# EAGLE design 491 Circuit Schematic For Actual PCB (EAGLE 9.5.0)
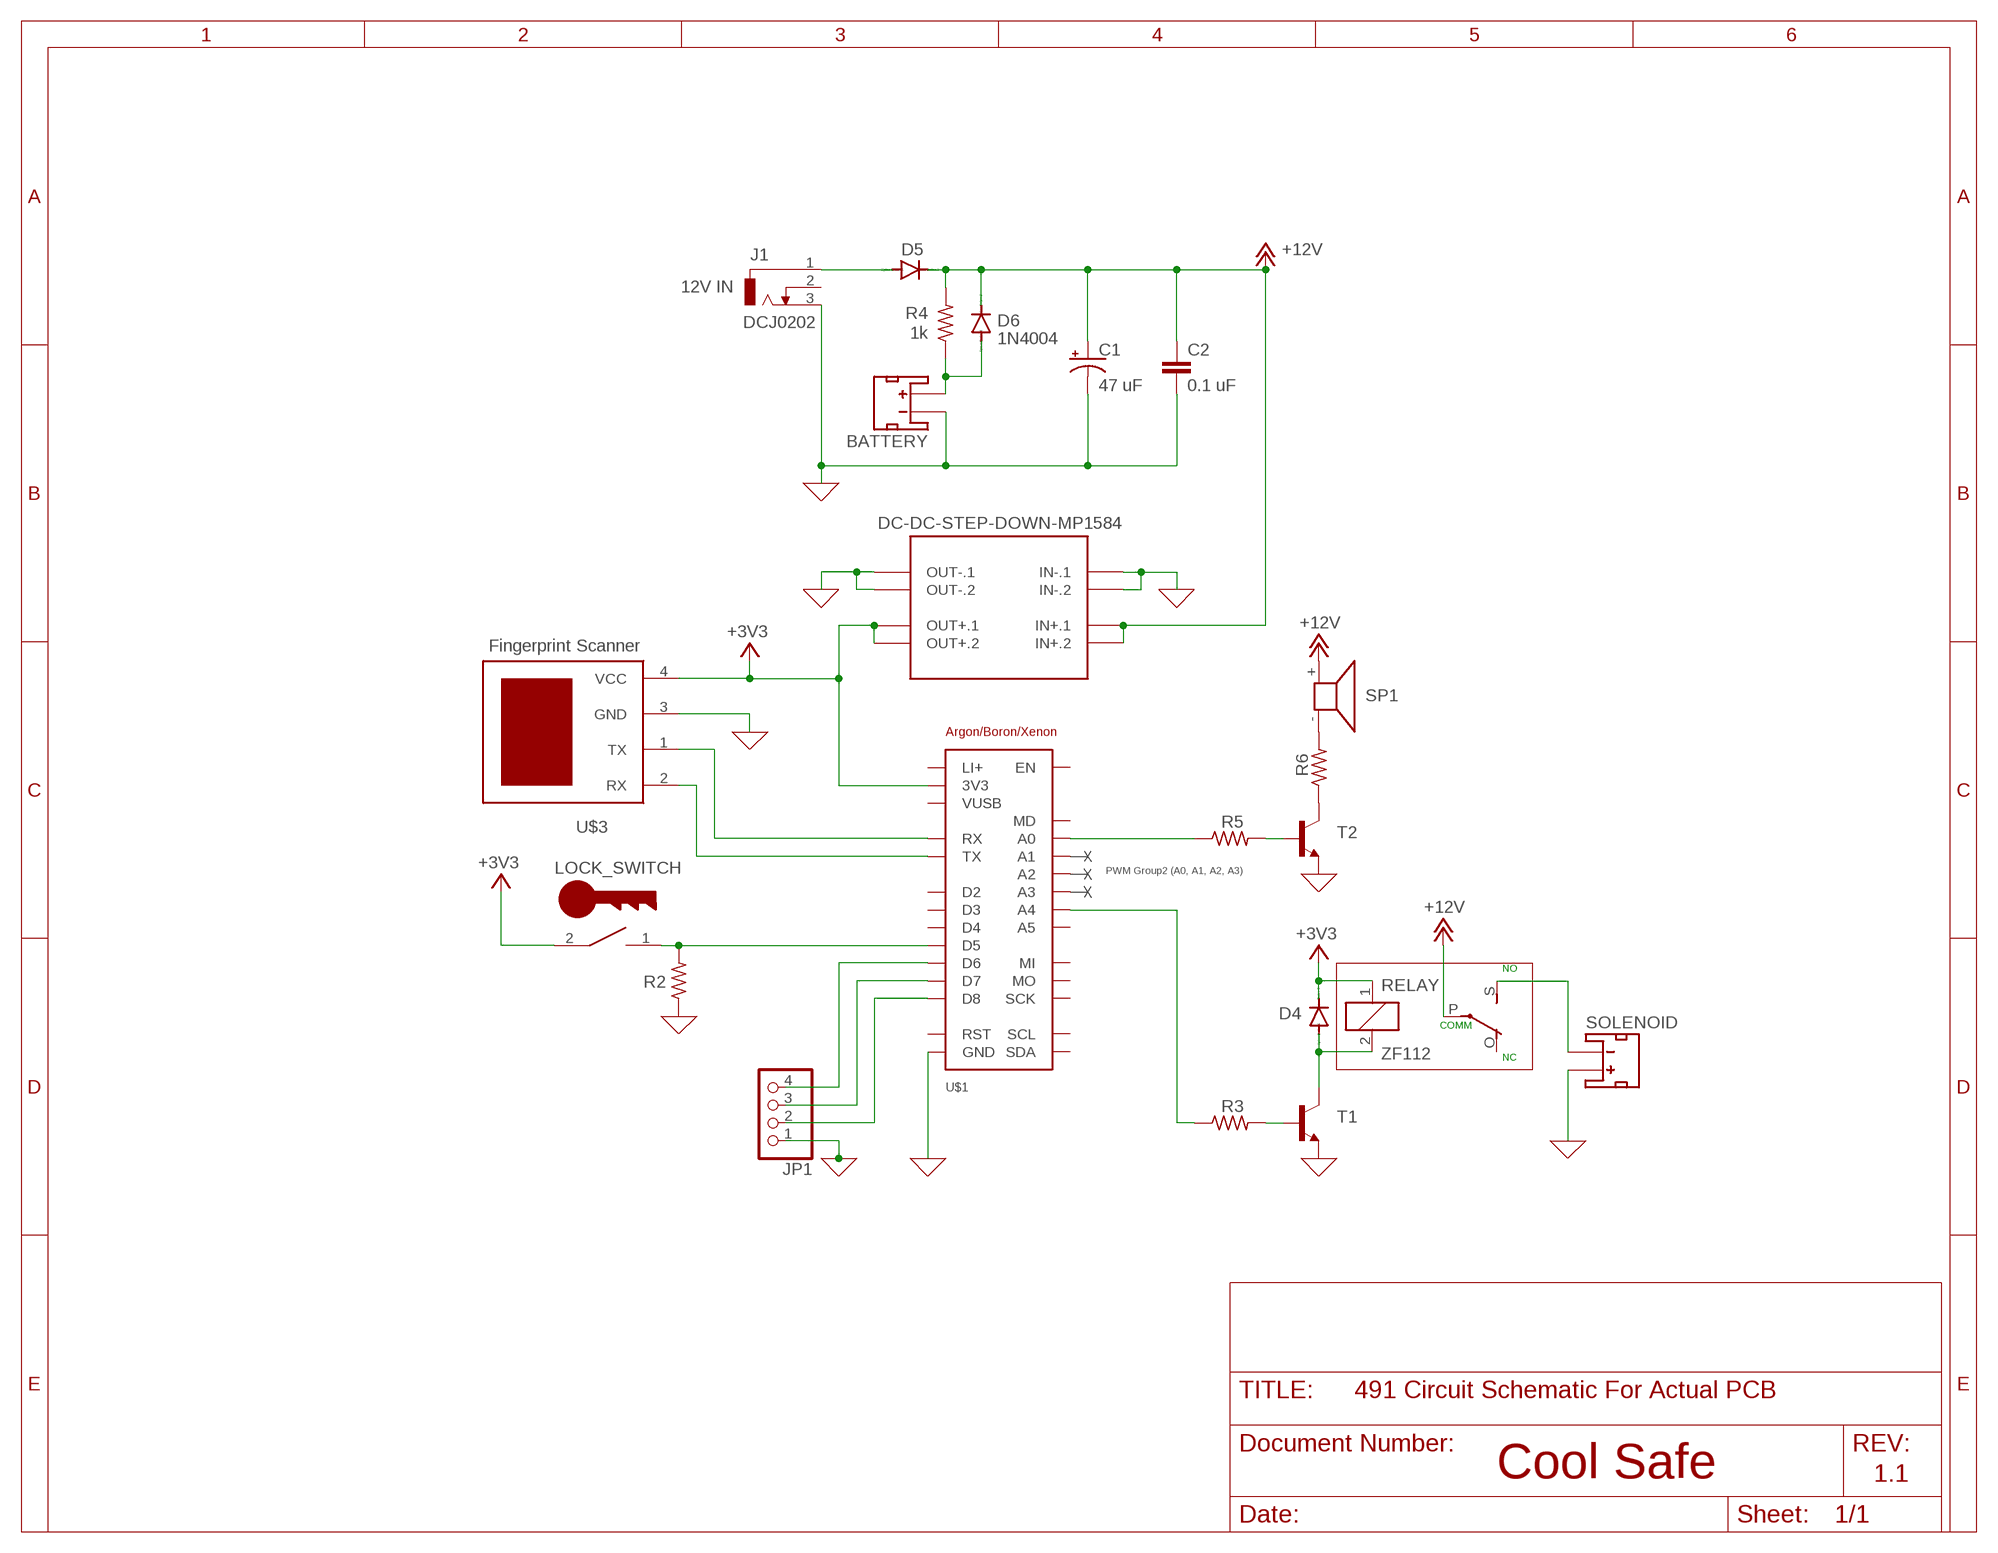
[diagram p0: schematic, sheet 1]

## Parts
BATTERY  JST_2MM_MALE  [JST-2-SMD]
C1  47 uF  CPOL-USE2.5-6  [E2,5-6]
C2  0.1 uF  C2.5/5  [C2.5-5]
D4  1N4004  [DO41-10]
D5  1N4004  [DO41-10]
D6  1N4004  [DO41-10]
J1  DCJ0202  [DCJ0202]
JP1  PINHD-1X4/90  [1X04/90]
LOCK_SWITCH  LOCK_SWITCHSCREW_TERMINAL  [1751248]
R2  R-US_0207/10  [0207/10]
R3  R-US_0204/7  [0204/7]
R4  1k  R-US_0207/10  [0207/10]
R5  R-US_0204/7  [0204/7]
R6  R-US_0204/7  [0204/7]
RELAY  ZF112  [ZF112]
SOLENOID  JST_2MM_MALE  [JST-2-SMD]
SP1  KSS1201  [KSS1201]
T1  -NPN-TO92  [TO92]
T2  -NPN-TO92  [TO92]
U$1  TEMPLATE_ARGON/BORON/XENONFEATHER_ONLY  [FEATHER_ONLY]
U$2  DC-DC-STEP-DOWN-MP1584  [DC-DC-STEP-DOWN-MP1584]
U$3  FPSQWIIC  [1X04_1MM_RA]

## Nets
0: BATTERY.1(-) C1.- C2.2 J1.3 JP1.1 R2.1 SOLENOID.2(+) T1.1(E) T2.1(E) U$1.16B(GND) U$1.16T(GND) U$1.P$16(GND) U$2.IN-.1 U$2.IN-.2 U$2.OUT-.1 U$2.OUT-.2 U$3.3(GND) ; supply symbol labelled GND
+3V3: D4.C LOCK_SWITCH.2 RELAY.1 U$1.14B(3V3) U$1.14T(3V3) U$1.P$14(3V3) U$2.OUT+.1 U$2.OUT+.2 U$3.4(VCC)
+12V: C1.+ C2.1 D5.C D6.C R4.2 RELAY.P(2:P) SP1.+ U$2.IN+.1 U$2.IN+.2
N$1: BATTERY.2(+) D6.A R4.1
N$2: R5.2 T2.2(B)
N$4: R5.1 U$1.17B(A0) U$1.17T(A0) U$1.P$17(A0)
N$6: JP1.4 U$1.06B(D6) U$1.06T(D6) U$1.P$6(D6)
N$7: JP1.3 U$1.05B(D7) U$1.05T(D7) U$1.P$5(D7)
N$8: JP1.2 U$1.04B(D8) U$1.04T(D8) U$1.P$4(D8)
N$9: LOCK_SWITCH.1 R2.2 U$1.07B(D5) U$1.07T(D5) U$1.P$7(D5)
N$11: D4.A RELAY.2 T1.3(C)
N$13: RELAY.S(2:S) SOLENOID.1(-)
N$15: R6.1 T2.3(C)
N$16: U$1.26B(RX) U$1.26T(RX) U$1.P$26(RX) U$3.1(TX)
N$17: R3.2 T1.2(B)
N$18: R3.1 U$1.21B(A4) U$1.21T(A4) U$1.P$21(A4)
N$28: U$1.27B(TX) U$1.27T(TX) U$1.P$27(TX) U$3.2(RX)
N$29: D5.A J1.1
N$31: R6.2 SP1.-
Unconnected: BATTERY.NC1(PAD1) BATTERY.NC2(PAD2) J1.2 RELAY.O(2:O) SOLENOID.NC1(PAD1) SOLENOID.NC2(PAD2) U$1.01B(LI+) U$1.01T(LI+) U$1.02B(EN) U$1.02T(EN) U$1.03B(VUSB) U$1.03T(VUSB) U$1.08B(D4) U$1.08T(D4) U$1.09B(D3) U$1.09T(D3) U$1.10B(D2) U$1.10T(D2) U$1.11B(SCL) U$1.11T(SCL) U$1.12B(SDA) U$1.12T(SDA) U$1.13B(RST) U$1.13T(RST) U$1.15B(MD) U$1.15T(MD) U$1.18B(A1) U$1.18T(A1) U$1.19B(A2) U$1.19T(A2) U$1.20B(A3) U$1.20T(A3) U$1.22B(A5) U$1.22T(A5) U$1.23B(SCK) U$1.23T(SCK) U$1.24B(MO) U$1.24T(MO) U$1.25B(MI) U$1.25T(MI) U$1.P$1(LI+) U$1.P$2(EN) U$1.P$3(VUSB) U$1.P$8(D4) U$1.P$9(D3) U$1.P$10(D2) U$1.P$11(SCL) U$1.P$12(SDA) U$1.P$13(RST) U$1.P$15(MD) U$1.P$18(A1) U$1.P$19(A2) U$1.P$20(A3) U$1.P$22(A5) U$1.P$23(SCK) U$1.P$24(MO) U$1.P$25(MI)

## Notes on the sheet
- 12V IN
- Fingerprint Scanner
- PWM Group2 (A0, A1, A2, A3)
- NO
- COMM
- NC
- Cool Safe | 1.1

## Library data of the parts
BATTERY SOLENOID = cool_safe_lib:JST_2MM_MALE: JST 2MM MALE RA CONNECTOR Two pin, compact surface mount connector. Commonly used as a battery input connection point. We really like the solid locking feeling and high current rating on these small connectors. We use these all the time as battery connectors. Mates to single-cell LiPo batteries. Here is the connector we sell at SparkFun: JST Right Angle Connector - White <https://www.sparkfun.com/products/8612> (PRT-08612) Datasheet <http://www.sparkfun.com/datasheets/Prototyping/Connectors/JST-Horizontal.pdf> It was used on these SparkFun products: SparkFun MOSFET Power Controller <https://www.sparkfun.com/products/11214> (PRT-11214) SparkFun Battery Babysitter - LiPo Battery Manager <https://www.sparkfun.com/products/13777> (PRT-13777) And many, many others that required a lipo battery connection.; PROD_ID: CONN-11443; SF_ID: PRT-08612
C1 = rcl:CPOL-US: POLARIZED CAPACITOR, American symbol; SPICEPREFIX: C
C2 = capacitor-wima:C: CAPACITOR naming: grid - package width
D4-D6 = diode:1N4004: DIODE general purpose rectifier, 1 A
J1 = con-jack:DCJ0202: DC POWER JACK Source: DCJ0202.pdf; OC_FARNELL: unknown; OC_NEWARK: unknown
JP1 = pinhead:PINHD-1X4: PIN HEADER
LOCK_SWITCH = cool_safe_lib:LOCK_SWITCH
R2-R6 = rcl:R-US_: RESISTOR, American symbol; SPICEPREFIX: R
RELAY = relay:ZF112: RELAY 1 x switch; OC_FARNELL: unknown; OC_NEWARK: unknown
SP1 = buzzer:KSS1201: SPEAKER Source: Schukat; OC_FARNELL: unknown; OC_NEWARK: unknown
T1 T2 = transistor:*-NPN-: NPN Transistror BF959 corrected 2008.03.06
U$1 = cool_safe_lib:TEMPLATE_ARGON/BORON/XENON
U$2 = cool_safe_lib:DC-DC-STEP-DOWN-MP1584: DC/DC Step-Down Regulator based on MP1584 chip MP1584 datasheet available here: http://www.haoyuelectronics.com/Attachment/MP1584/MP1584.pdf Click here to find device on ebay.com <http://www.ebay.com/sch/mp1584+module>
U$3 = cool_safe_lib:FPS

## Module SWITCHINGMODULE
Ports: 

### Library data of the parts

## Board
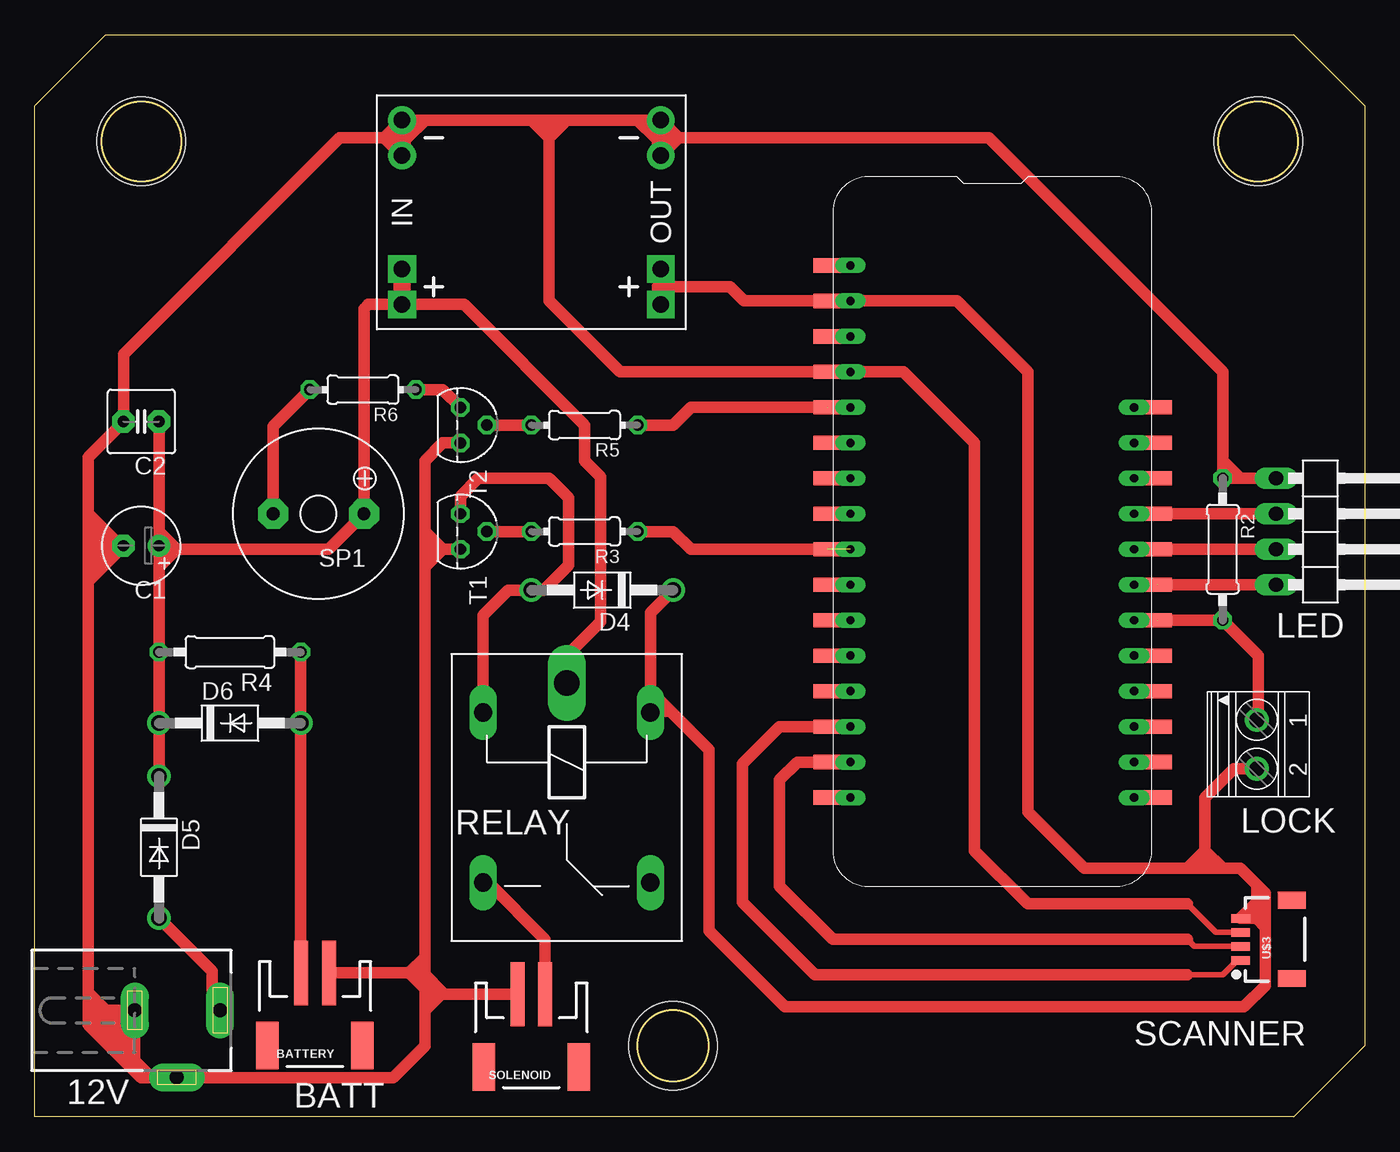
[diagram p1: board, top side]
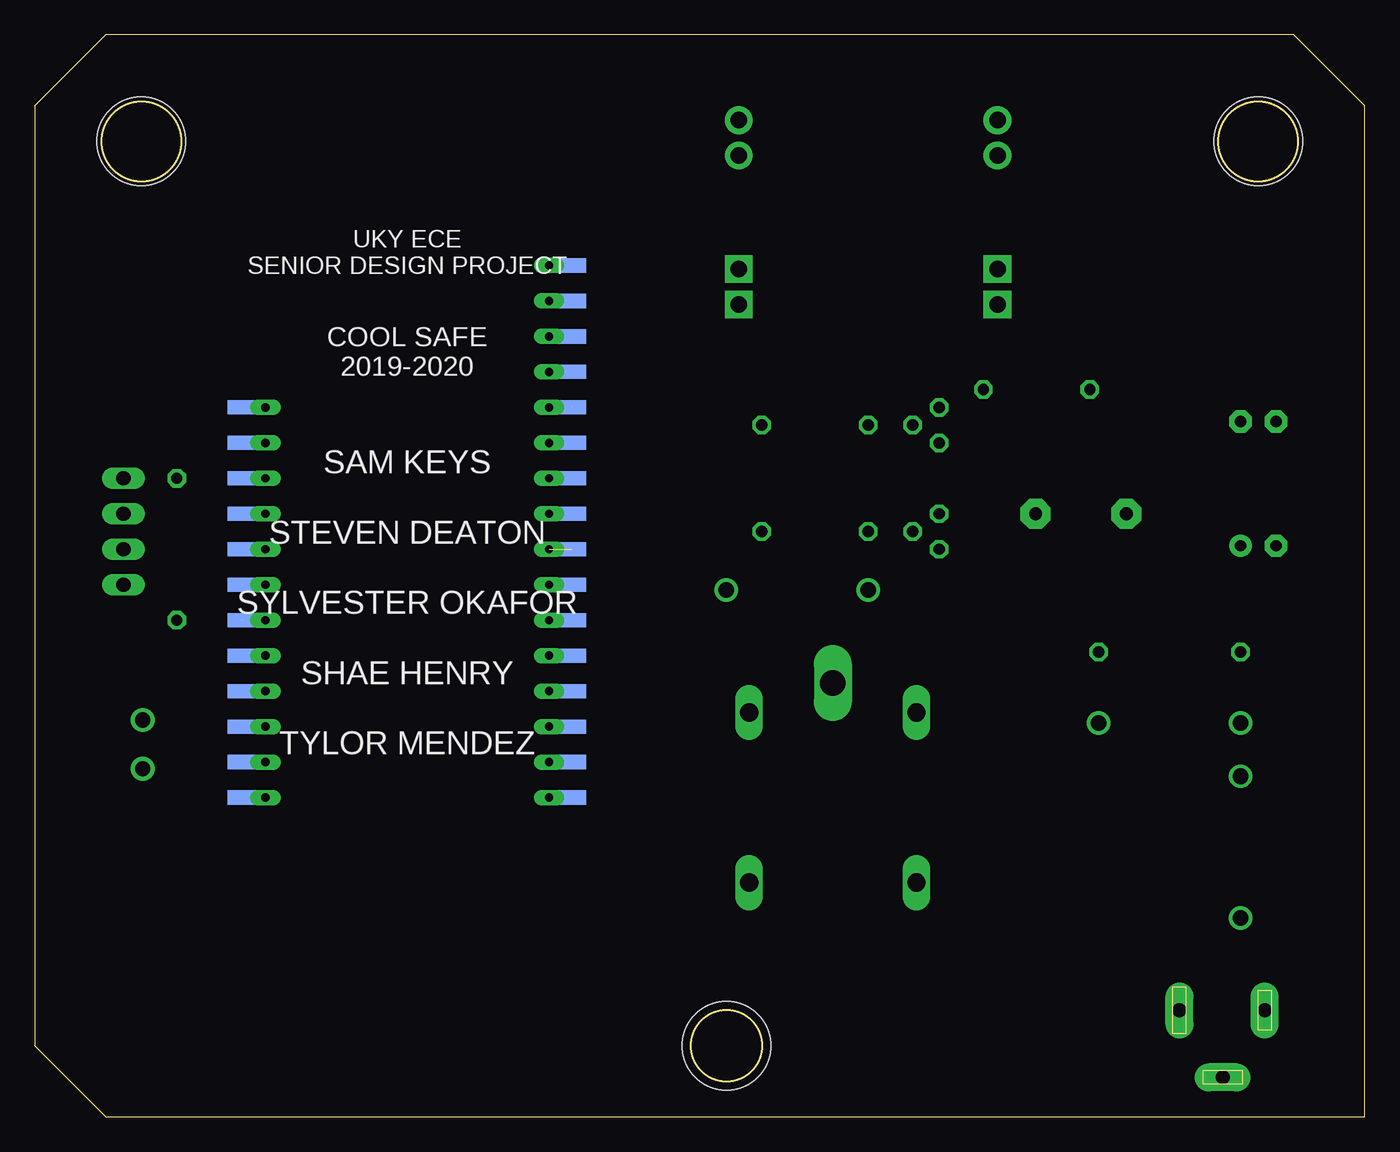
[diagram p2: board, bottom side, seen from below]

Size 95.25 x 77.47 mm. Coordinates in mm from the lower left corner, seen from the top.
Outline: 0,72.39 5.08,77.47 90.17,77.47 95.25,72.39 95.25,5.08 90.17,0 0,0 0,72.39
Outline: circle at 45.72,5.08 radius 2.54
Outline: circle at 7.62,69.85 radius 2.84
Outline: circle at 87.63,69.85 radius 2.84
Copper layers (1*16): Top 0.035mm / dielectric 1.5mm / Bottom 0.035mm
Design rules "default": minimum track width 6mil, minimum drill 0.35mm, track to track 6mil, track to pad 6mil, pad to pad 6mil, via to via 6mil, smd to smd 6mil, copper to edge 40mil, drill to drill 6mil, minimum pad ring 10mil, minimum via ring 8mil, stop-mask expansion 4mil, vias tented up to drill 0mil, thermal gap 10mil
Holes 6.35 mm at 7.62,69.85 87.63,69.85 45.72,5.08

### Footprints (pad centres in the part's own frame; a part is rotated, then mirrored left to right if it is on the bottom)
JST-2-SMD = smd 1 x 4.6: 1 -1,-3.7; 2 1,-3.7 | smd 1.6 x 3.4: NC1 -3.4,1.5; NC2 3.4,1.5
E2,5-6 = drill 0.813 pad 1.6: + -1.27,0 | drill 0.813 pad 1.6 octagon: - 1.27,0
C2.5-5 = drill 0.813 pad 1.6 octagon: 1 -1.27,0; 2 1.27,0
DO41-10 = drill 1.118: A 5.08,0; C -5.08,0
DCJ0202 = drill 1 pad 2 long: 1 0,3.1; 2 4.8,0; 3 0,-3
1X04/90 = drill 1.016 long: 1 -3.81,-3.81; 2 -1.27,-3.81; 3 1.27,-3.81; 4 3.81,-3.81
1751248 = drill 1.1 pad 1.7: 1 -1.75,-0.1; 2 1.75,-0.1
0207/10 = drill 0.813 octagon: 1 -5.08,0; 2 5.08,0
0204/7 = drill 0.813 octagon: 1 -3.81,0; 2 3.81,0
ZF112 = drill 1.321 long: 1 -6.096,5.994; 2 -6.096,-5.994; O 6.096,5.994; S 6.096,-5.994 | drill 1.803 long: P -8.204,0
KSS1201 = drill 0.914 pad 2.159 octagon: + 3.251,0; - -3.251,0
TO92 = drill 0.813 octagon: 1 1.27,0; 2 0,1.905; 3 -1.27,0
FEATHER_ONLY = smd 1.016 x 2.032 bottom: 01B 17.78,25.8; 02B 20.32,25.8; 03B 22.86,25.8; 04B 25.4,25.8; 05B 27.94,25.8; 06B 30.48,25.8; 07B 33.02,25.8; 08B 35.56,25.8; 09B 38.1,25.8; 10B 40.64,25.8; 11B 43.18,25.8; 12B 45.72,25.8; 13B 7.62,2.159; 14B 10.16,2.159; 15B 12.7,2.159; 16B 15.24,2.159; 17B 17.78,2.159; 18B 20.32,2.159; 19B 22.86,2.159; 20B 25.4,2.159; 21B 27.94,2.159; 22B 30.48,2.159; 23B 33.02,2.159; 24B 35.56,2.159; 25B 38.1,2.159; 26B 40.64,2.159; 27B 43.18,2.159; 28B 45.72,2.159 | smd 1.016 x 2.032: 01T 17.78,25.8; 02T 20.32,25.8; 03T 22.86,25.8; 04T 25.4,25.8; 05T 27.94,25.8; 06T 30.48,25.8; 07T 33.02,25.8; 08T 35.56,25.8; 09T 38.1,25.8; 10T 40.64,25.8; 11T 43.18,25.8; 12T 45.72,25.8; 13T 7.62,2.159; 14T 10.16,2.159; 15T 12.7,2.159; 16T 15.24,2.159; 17T 17.78,2.159; 18T 20.32,2.159; 19T 22.86,2.159; 20T 25.4,2.159; 21T 27.94,2.159; 22T 30.48,2.159; 23T 33.02,2.159; 24T 35.56,2.159; 25T 38.1,2.159; 26T 40.64,2.159; 27T 43.18,2.159; 28T 45.72,2.159 | drill 0.6 long: P$1 17.78,24.13; P$2 20.32,24.13; P$3 22.86,24.13; P$4 25.4,24.13; P$5 27.94,24.13; P$6 30.48,24.13; P$7 33.02,24.13; P$8 35.56,24.13; P$9 38.1,24.13; P$10 40.64,24.13; P$11 43.18,24.13; P$12 45.72,24.13; P$13 7.62,3.81; P$14 10.16,3.81; P$15 12.7,3.81; P$16 15.24,3.81; P$17 17.78,3.81; P$18 20.32,3.81; P$19 22.86,3.81; P$20 25.4,3.81; P$21 27.94,3.81; P$22 30.48,3.81; P$23 33.02,3.81; P$24 35.56,3.81; P$25 38.1,3.81; P$26 40.64,3.81; P$27 43.18,3.81; P$28 45.72,3.81
DC-DC-STEP-DOWN-MP1584 = drill 1.2 pad 2 square: IN+.1 -9.271,-4.064; IN+.2 -9.271,-6.604; OUT+.1 9.271,-4.064; OUT+.2 9.271,-6.604 | drill 1.2 pad 2: IN-.1 -9.271,6.604; IN-.2 -9.271,4.064; OUT-.1 9.271,6.604; OUT-.2 9.271,4.064
1X04_1MM_RA = smd 0.6 x 1.35: 1 -1.5,0; 2 -0.5,0; 3 0.5,0; 4 1.5,0 | smd 1.2 x 2: NC1 2.8,-3.675; NC2 -2.8,-3.675

### Placement (x,y rotation side)
BATTERY  20.07,6.6 180 top
C1  7.62,40.89 180 top
C2  7.62,49.78 180 top
D4  40.64,37.72 180 top
D5  8.89,19.3 270 top
D6  13.97,28.19 0 top
J1  10.16,7.62 270 top
JP1  92.71,41.91 270 top
LOCK_SWITCH  87.63,26.67 270 top
R2  85.09,40.64 270 top
R3  39.37,41.91 180 top
R4  13.97,33.27 180 top
R5  39.37,49.53 180 top
R6  23.5,52.07 180 top
RELAY  38.1,22.86 270 top
SOLENOID  35.56,5.08 180 top
SP1  20.32,43.18 0 top
T1  30.48,41.91 270 top
T2  30.48,49.53 270 top
U$1  54.61,68.58 270 top
U$2  35.56,64.77 0 top
U$3  86.36,12.7 90 top

### Tracks (layer width: path | path; a pad name or v marks a point on that pad's centre or on a via)
0
  Top 0.406: 26.04,71.12 U$2.IN-.1 | U$3.3 84.59,13.2 82.55,15.24
  Top 0.813: 3.81,39.5 3.81,38.35 | 3.81,39.5 3.81,40.89 | 3.81,40.89 3.81,42.04 | 3.81,42.04 3.81,43.18 | 3.81,43.18 3.81,47.24 C2.2 6.35,54.61 21.84,70.1 25.02,70.1 | C1.- 3.81,40.89 | 7.11,3.3 7.62,2.79 8.38,2.79 | 7.11,3.3 3.81,6.6 | 8.38,2.79 25.65,2.79 27.94,5.08 27.94,7.62 | 27.94,71.37 U$2.IN-.1 25.02,70.1 | 35.56,71.37 27.94,71.37 | 35.56,71.37 36.83,71.37 | 36.83,71.37 38.1,71.37 | 38.1,71.37 43.18,71.37 | 43.18,71.37 U$2.OUT-.1 46.1,70.1 | 36.83,70.1 36.83,58.42 41.91,53.34 U$1.P$16 62.23,53.34 67.31,48.26 67.31,19.05 71.12,15.24 82.55,15.24 | 36.83,70.1 36.83,71.37 | 29.21,40.64 27.94,39.37 | 27.94,10.16 27.94,9.18 | 27.94,8.89 27.94,7.62 | 29.21,40.64 T1.1 27.94,40.64 | 29.21,40.64 27.94,41.91 | R2.1 86.36,45.72 85.09,46.99 | 85.09,46.99 85.09,53.34 68.33,70.1 46.1,70.1 | 85.09,46.99 R2.1 | 27.94,41.91 27.94,46.99 29.21,48.26 T2.1 | C1.- 3.81,38.35 | C1.- 6.1,40.89 3.81,43.18 | C1.- 4.95,40.89 3.81,42.04 | C1.- 5.21,40.89 3.81,39.5 | 35.56,71.37 36.83,70.1 | 36.83,70.1 38.1,71.37 | 25.02,70.1 26.29,70.1 26.67,70.1 27.94,71.37 | 46.1,70.1 44.83,70.1 44.45,70.1 43.18,71.37 | U$2.IN-.2 25.02,70.1 | U$2.OUT-.2 46.1,70.1 | 29.1,8.78 28.05,8.78 27.94,8.89 | 29.1,8.78 29.21,8.78 | 29.1,8.78 27.94,7.62 | 29.21,8.78 29.21,8.89 27.94,10.16 | JP1.1 R2.1 | 3.81,38.35 3.81,8.89 | 3.81,8.89 3.81,7.62 | 3.81,7.62 3.81,6.6 | 27.94,41.91 27.94,40.64 | 27.94,40.64 27.94,39.37 | 27.94,39.37 27.94,11.43 | 27.94,11.43 27.94,10.16 | 5.08,7.62 3.81,7.62 | 6.35,7.62 J1.3 7.16,4.02 | 3.81,8.89 5.08,7.62 | 7.16,4.02 7.16,3.35 7.11,3.3 | 7.16,4.02 8.38,2.79 | 4.06,6.6 4.57,6.6 4.95,6.22 | 4.95,6.22 5.52,5.65 | 5.52,5.65 6.22,4.95 | 6.22,4.95 7.16,4.02 | 5.08,7.62 4.06,6.6
  Top 0.813: 4.06,6.6 3.81,6.6 | 5.08,7.62 5.08,6.48 | 5.08,6.48 5.08,6.35 4.95,6.22 | 6.35,6.48 6.35,5.08 6.22,4.95 | 5.08,7.62 6.35,7.62 | 6.35,7.62 6.35,6.48 | 6.35,6.48 5.52,5.65 | 6.35,7.62 5.21,6.48 5.08,6.48 | SOLENOID.2 29.21,8.78 | BATTERY.1 26.81,10.3 | 26.81,10.3 27.94,11.43 | 26.81,10.3 27.94,9.18 | 27.94,9.18 27.94,8.89 | 27.94,10.16 27.8,10.3 26.81,10.3
  Top 1.27: U$2.IN-.2 26.29,70.1 U$2.IN-.1 | U$2.OUT-.1 44.83,70.1 U$2.OUT-.2
+3V3
  Top 0.813: D4.C 44.1,36.1 44.1,30.48 | 85.09,17.78 86.36,17.78 87.63,16.51 | 82.55,17.78 75.18,17.78 71.12,21.84 71.12,53.34 66.04,58.42 U$1.P$14 50.8,58.42 49.78,59.44 44.83,59.44 U$2.OUT+.1 | 85.09,17.78 83.82,19.05 | 83.82,19.05 82.55,17.78 | 44.1,30.48 RELAY.1 44.17,29.04 45.55,29.04 | 45.55,29.04 48.29,26.29 48.29,13.3 53.72,7.87 86.61,7.87 88.14,9.4 88.14,13.59 | 45.55,29.04 44.1,30.48 | 83.82,19.05 83.82,22.86 85.88,24.92 LOCK_SWITCH.2 | 87.63,16.51 88.14,16 88.14,13.59 | U$3.4 87.53,14.2 | 88.14,13.59 87.53,14.2 | 87.53,14.2 87.53,15.24 | 87.53,15.24 87.53,15.37 | 87.63,16.51 87.53,16.41 87.53,15.37 | U$3.4 86.49,14.2 87.53,15.24 | U$3.4 87.53,15.37 | 82.55,17.78 83.82,17.78 | 83.82,17.78 85.09,17.78 | 83.82,19.05 83.82,17.78
  Top 1.27: 44.83,59.44 U$2.OUT+.2
+12V
  Top 0.813: D5.C D6.C R4.2 C1.+ | C2.1 8.89,41.91 | C1.+ 8.89,40.64 10.16,40.64 | C1.+ 8.89,39.37 10.16,40.64 | 8.89,41.91 C1.+ | 10.16,40.64 21.03,40.64 SP1.+ 23.57,57.86 23.88,58.17 U$2.IN+.2 30.73,58.17 39.37,49.53 39.37,46.99 40.51,45.85 40.51,35.43 38.1,33.02 RELAY.P | 10.16,40.64 8.89,41.91
  Top 1.27: U$2.IN+.1 U$2.IN+.2
N$1
  Top 0.813: R4.1 D6.A 19.05,10.32 BATTERY.2
N$2
  Top 0.813: R5.2 T2.2
N$4  (1 unrouted)
  Top 0.813: U$1.17T U$1.P$17 46.99,50.8 45.72,49.53 R5.1
N$6  (1 unrouted)
  Top 0.813: JP1.4 U$1.06B U$1.P$6
N$7
  Top 0.813: JP1.3 U$1.05T U$1.P$5
N$8
  Top 0.813: JP1.2 U$1.04T U$1.P$4
N$9  (1 unrouted)
  Top 0.813: U$1.P$7 U$1.07T R2.2 87.63,33.02 87.63,28.52 LOCK_SWITCH.1
N$11
  Top 0.813: T1.3 30.48,44.45 31.75,45.72 36.83,45.72 38.23,44.32 38.23,39.5 36.45,37.72 D4.A 33.91,37.72 32.11,35.92 RELAY.2
N$13
  Top 0.813: SOLENOID.1 36.56,12.69 32.49,16.76 RELAY.S
N$15
  Top 0.813: R6.1 29.21,52.07 T2.3
N$16
  Top 0.406: U$3.1 86.13,11.2 85.09,10.16 82.55,10.16
  Top 0.813: U$1.P$26 U$1.26T 53.34,27.94 50.67,25.27 50.67,15.37 55.88,10.16 82.55,10.16
N$17
  Top 0.813: R3.2 T1.2
N$18  (2 unrouted)
  Top 0.813: R3.1 45.72,41.91 46.99,40.64 U$1.P$21
N$28
  Top 0.406: U$3.2 83.05,12.2 82.55,12.7
  Top 0.813: U$1.27B 54.61,25.4 53.34,24.13 53.34,16.51 57.15,12.7 82.55,12.7
N$29
  Top 0.813: J1.1 12.7,8.18 12.7,10.41 D5.A
N$31
  Top 0.813: R6.2 17.07,49.45 SP1.-

### Text on the board
tNames: LED | LOCK | SCANNER | 12V | BATT
bNames: UKY ECE / SENIOR DESIGN PROJECT | COOL SAFE / 2019-2020 | SAM KEYS / / STEVEN DEATON / / SYLVESTER OKAFOR / / SHAE HENRY / / TYLOR MENDEZ